# Altium schematic sheet 系统框图_V1.0_20210719.SchDoc
size A3
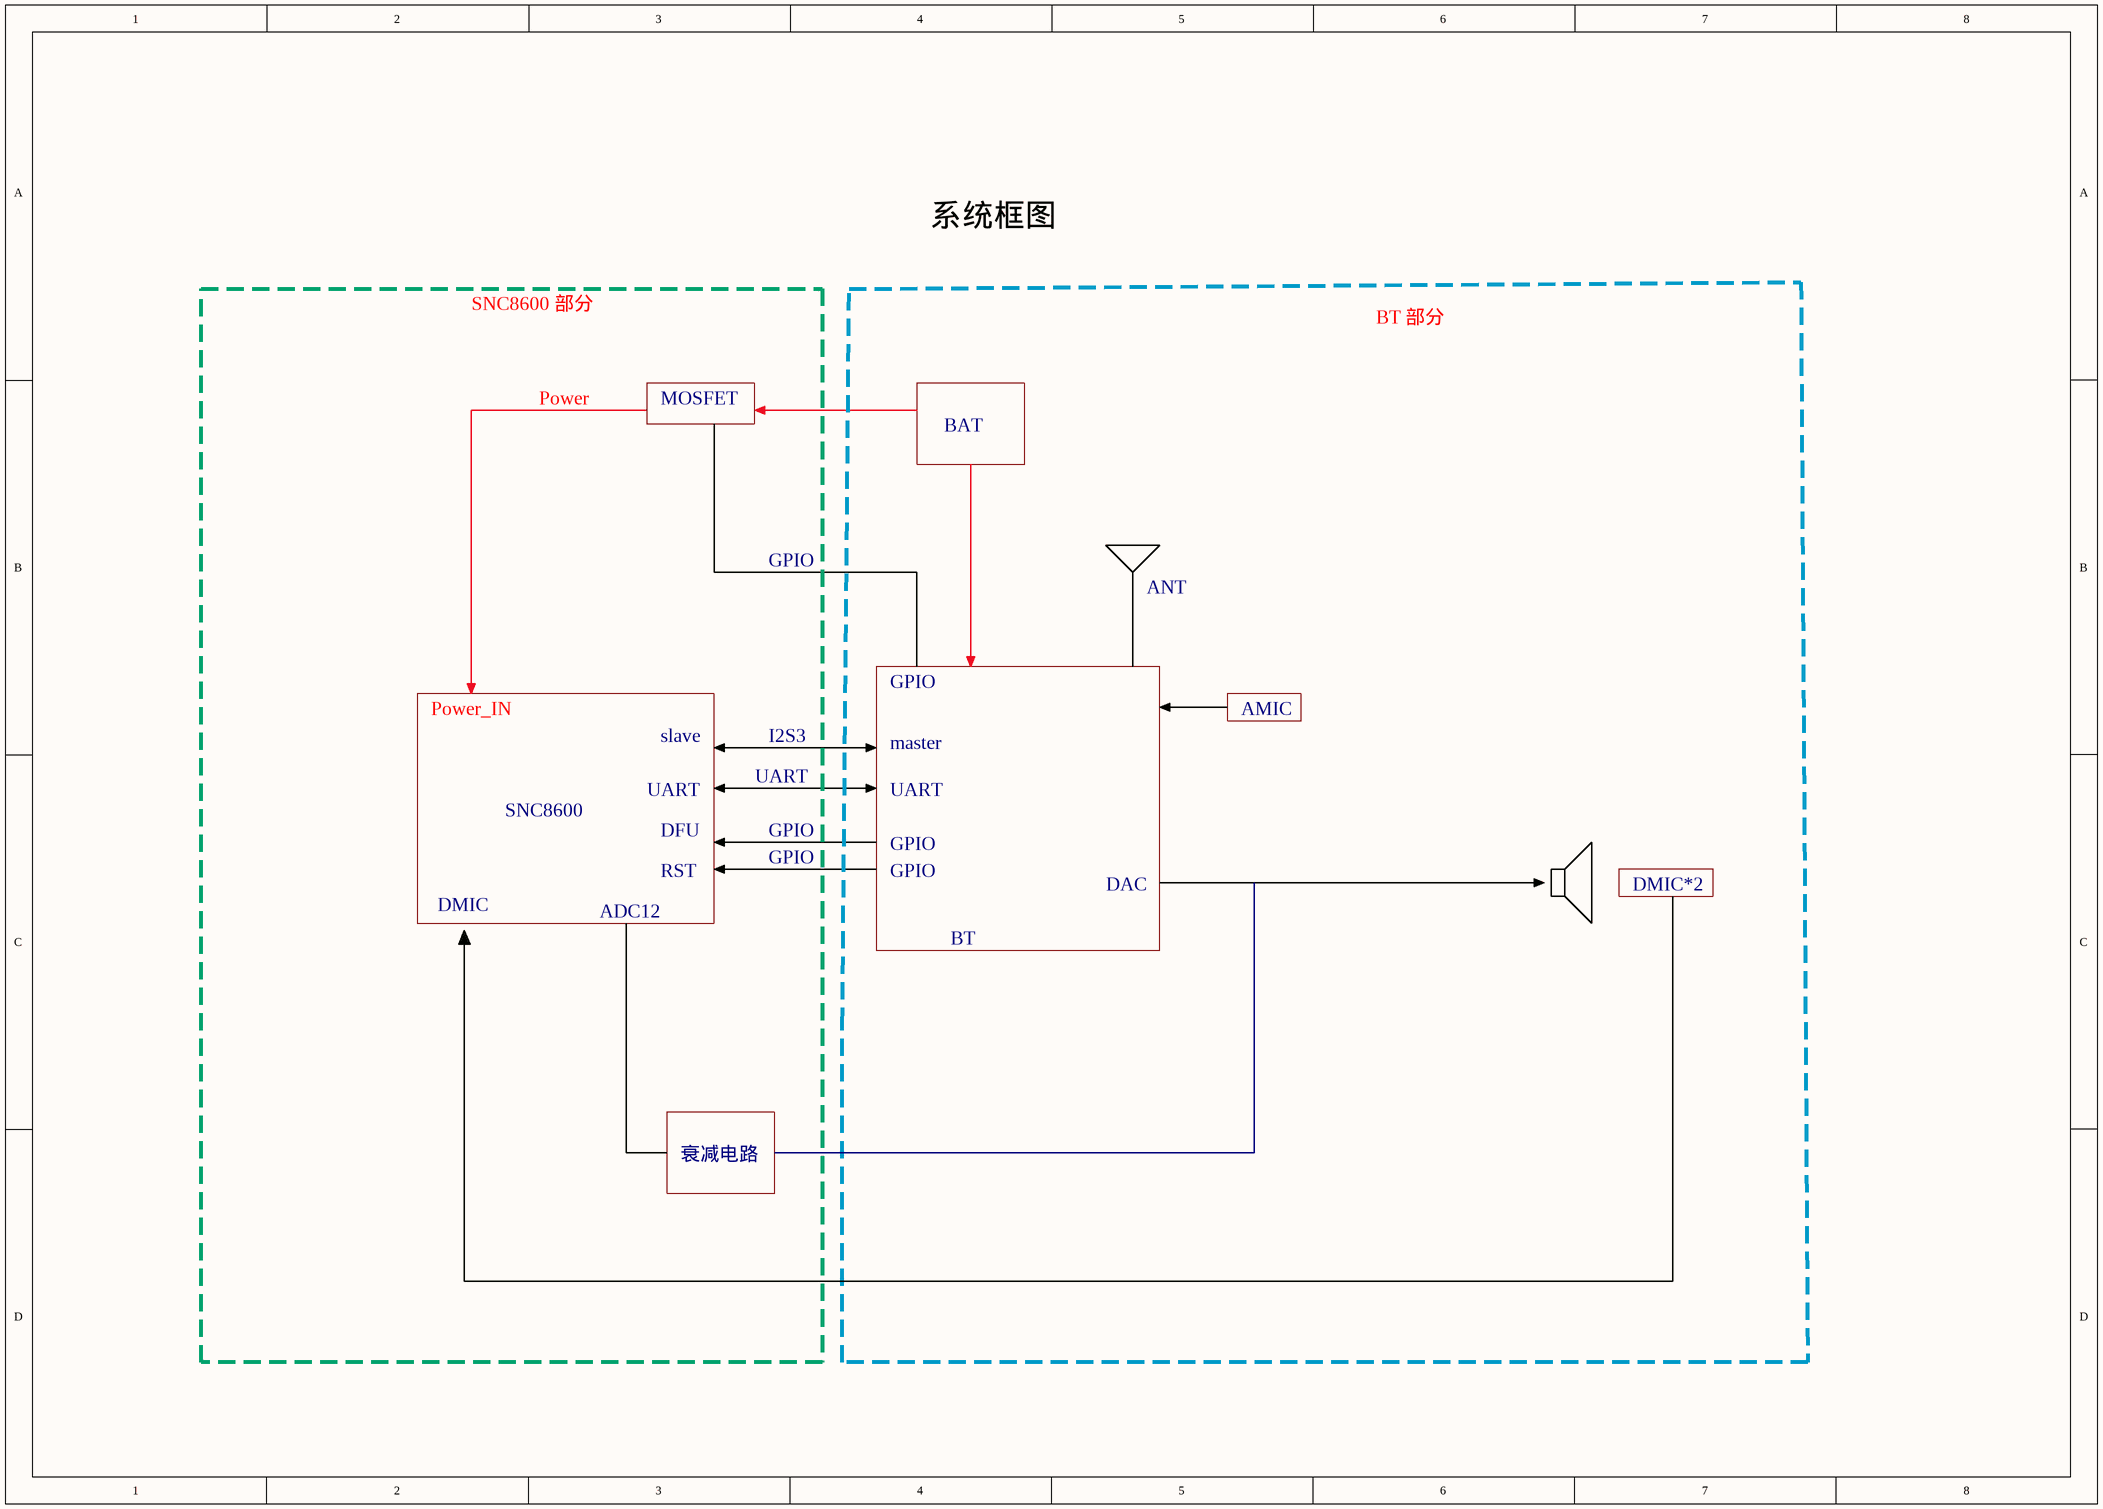
[diagram p0: 系统框图_V1.0_20210719.SchDoc]

## Notes on the sheet
- 系统框图
- SNC8600 部分
- BT 部分
- Power
- MOSFET
- BAT
- GPIO
- ANT
- Power_IN
- AMIC
- slave
- UART
- I2S3
- master
- SNC8600
- DFU
- DMIC
- ADC12
- RST
- DAC
- DMIC*2
- BT
- 衰减电路